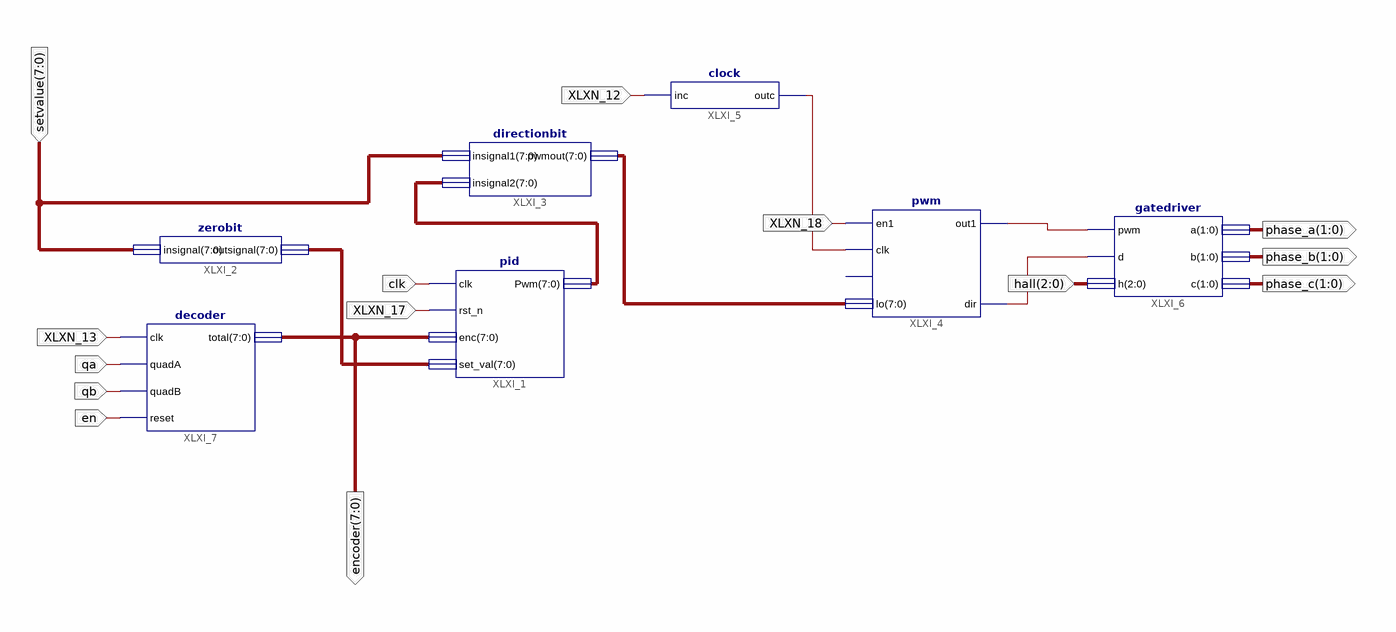
[diagram p0: schematic sheet 1]
// Xilinx ISE schematic driverformotor.sch (spartan6) as structural Verilog: 7 symbols, 14 ports
module driverformotor (
  input  [7:0] setvalue,
  input  clk,
  input  XLXN_12,
  input  XLXN_13,
  input  qa,
  input  qb,
  input  en,
  input  XLXN_17,
  input  XLXN_18,
  input  [2:0] hall,
  output [1:0] phase_a,
  output [1:0] phase_b,
  output [1:0] phase_c,
  output [7:0] encoder
);

  wire XLXN_6, XLXN_7, XLXN_20;
  wire [7:0] XLXN_3, XLXN_15, XLXN_99;

  pid XLXI_1 (.clk(clk), .rst_n(XLXN_17), .enc(encoder), .set_val(XLXN_99), .Pwm(XLXN_3));
  zerobit XLXI_2 (.insignal(setvalue), .outsignal(XLXN_99));
  directionbit XLXI_3 (.insignal1(setvalue), .insignal2(XLXN_3), .pwmout(XLXN_15));
  pwm XLXI_4 (.en1(XLXN_18), .clk(XLXN_6), .lo(XLXN_15), .out1(XLXN_7), .dir(XLXN_20));  // open: cl
  clock XLXI_5 (.inc(XLXN_12), .outc(XLXN_6));
  gatedriver XLXI_6 (.pwm(XLXN_7), .d(XLXN_20), .h(hall), .a(phase_a), .b(phase_b), .c(phase_c));
  decoder XLXI_7 (.clk(XLXN_13), .quadA(qa), .quadB(qb), .reset(en), .total(encoder));
endmodule
